# Altium project LimeSDR-PCIe_1v3.PrjPcb (part 7 of 7)
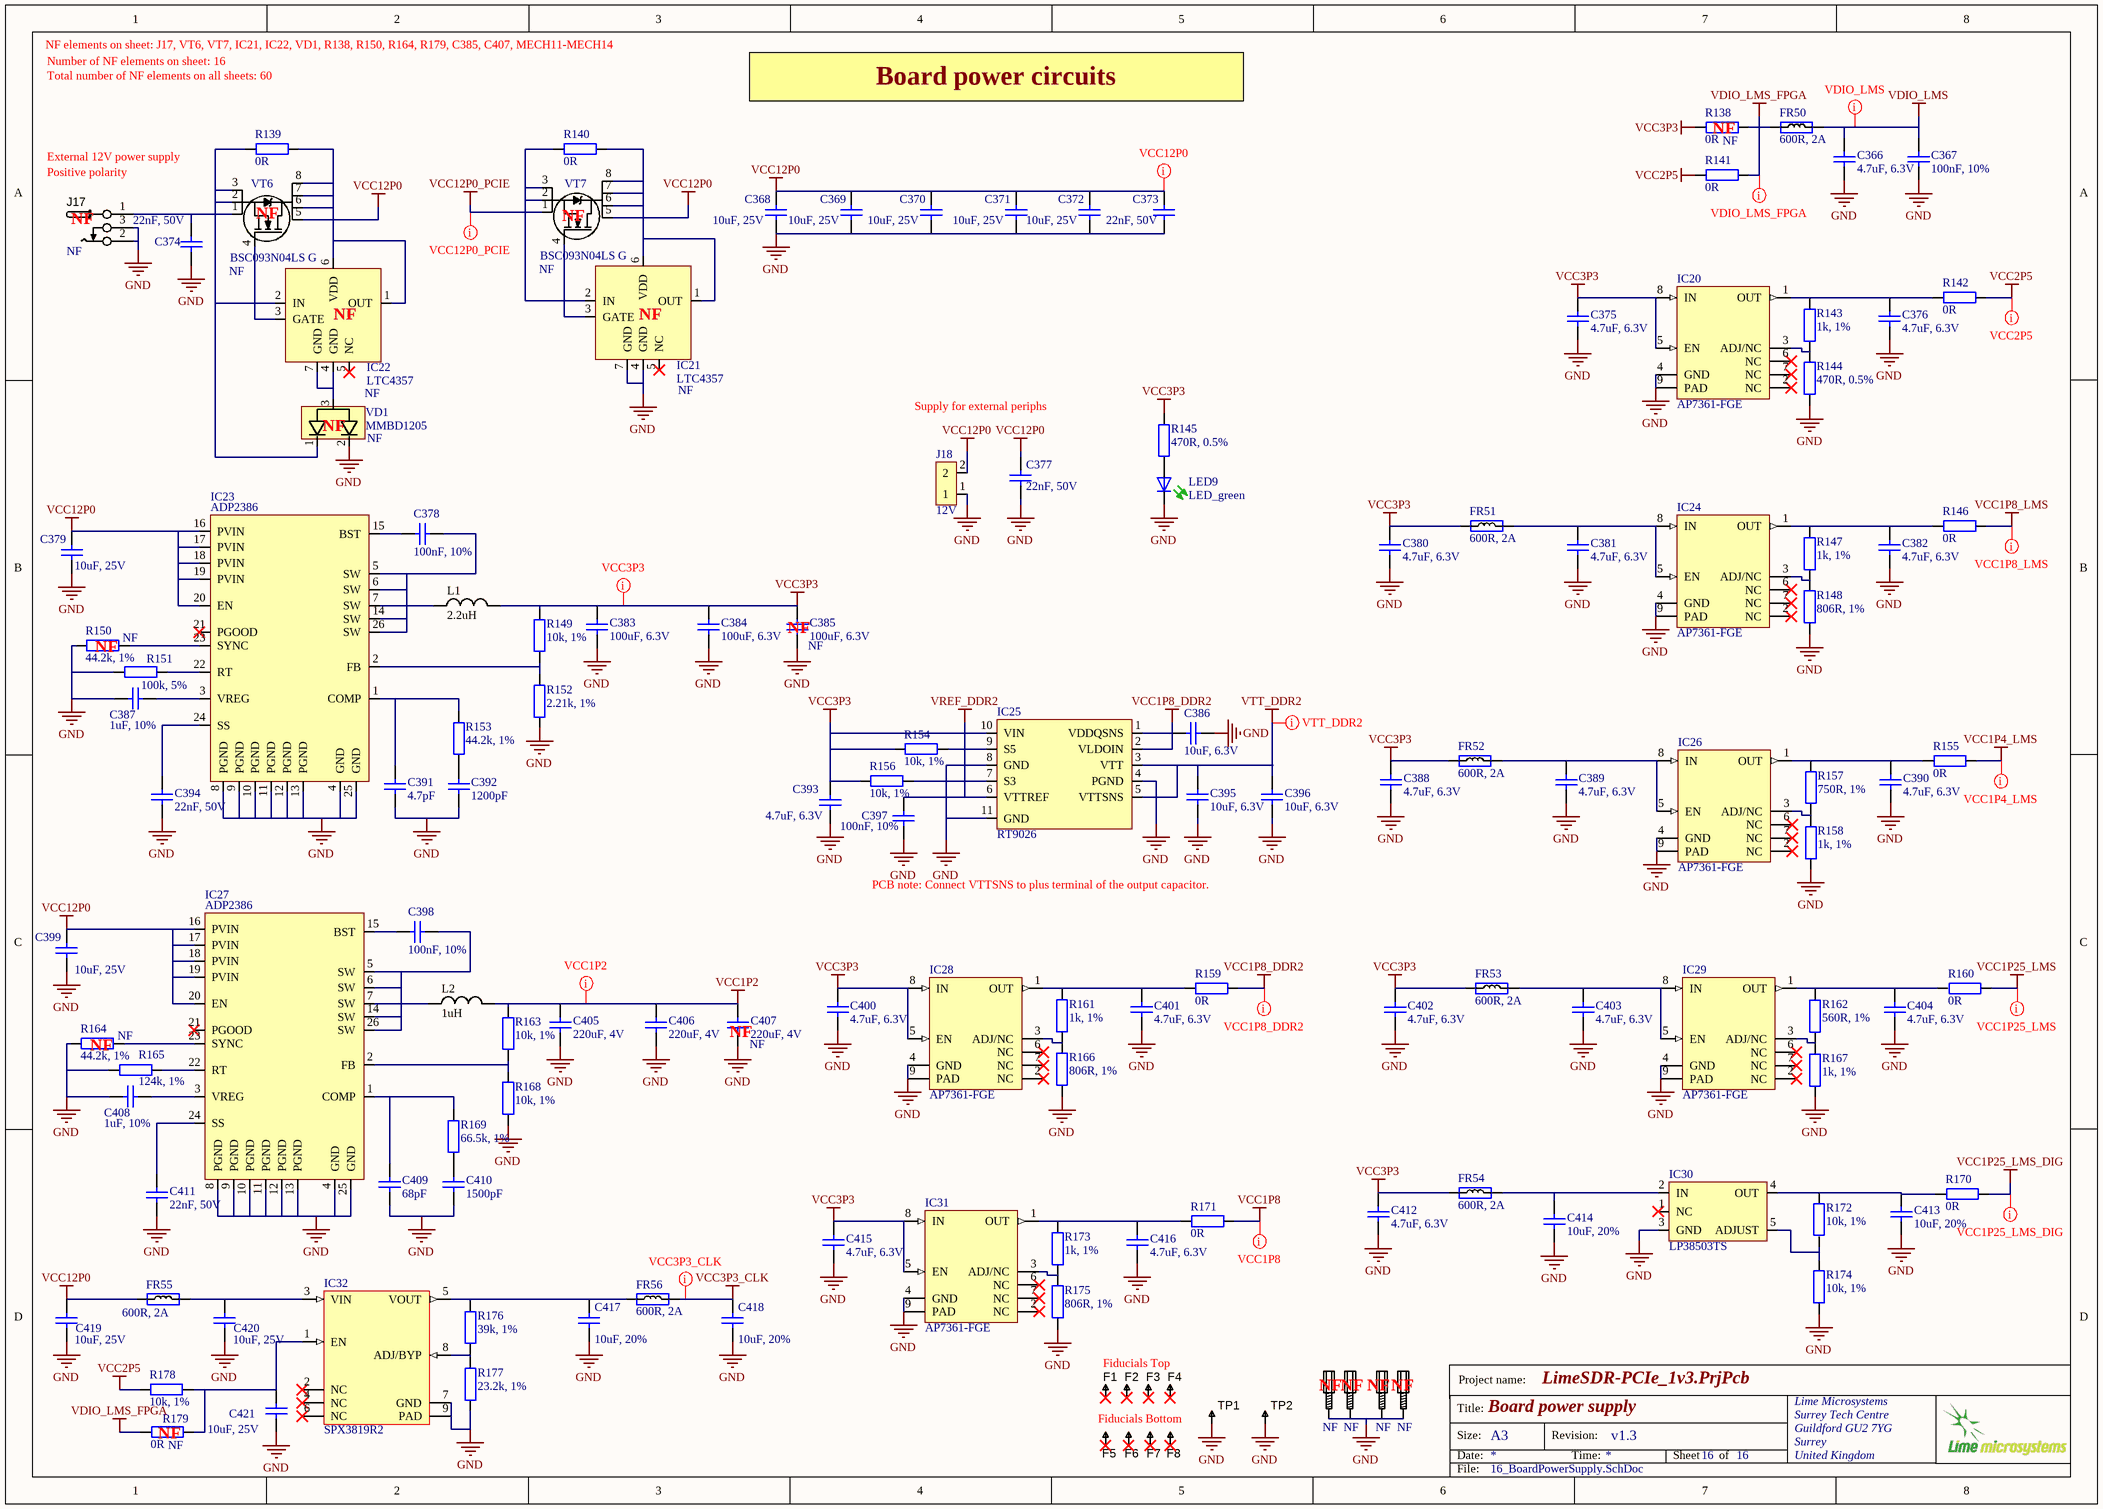
[diagram p17: 16_BoardPowerSupply.SchDoc]

## Nets that join several sheets
GND: 04_LMS7002M_Misc (13 pins), 05_LMS7002M_RF1 (41 pins), 06_LMS7002M_RF2 (31 pins), 07_LMS7002M_Power (84 pins), 08_FPGA_banks_3_4_5 (11 pins), 09_FPGA_banks_6_7_8 (17 pins), 10_FPGA_misc (13 pins), 11_FPGA_power (212 pins), 12_DDR2 (103 pins), 13_Periphs (55 pins), 14_Clocks_1 (74 pins), 15_Clocks_2 (9 pins), 16_BoardPowerSupply (115 pins)
VCC1P2: 11_FPGA_power (71 pins), 16_BoardPowerSupply (5 pins)
VCC1P4_LMS: 07_LMS7002M_Power (6 pins), 16_BoardPowerSupply (R155.1)
VCC1P8: 08_FPGA_banks_3_4_5 (R40.2 R42.2), 10_FPGA_misc (R63.1 R64.1), 11_FPGA_power (30 pins), 14_Clocks_1 (C354.1 FR42.1 IC19.14), 15_Clocks_2 (FR47.1 FR48.1), 16_BoardPowerSupply (R171.1)
VCC1P8_DDR2: 12_DDR2 (73 pins), 16_BoardPowerSupply (C386.2 IC25.1 IC25.2 R159.1)
VCC1P8_LMS: 05_LMS7002M_RF1 (9 pins), 06_LMS7002M_RF2 (9 pins), 07_LMS7002M_Power (11 pins), 16_BoardPowerSupply (R146.1)
VCC1P25_LMS: 07_LMS7002M_Power (22 pins), 16_BoardPowerSupply (R160.1)
VCC1P25_LMS_DIG: 07_LMS7002M_Power (R28.2 R29.2 R30.2 R31.2), 16_BoardPowerSupply (R170.1)
VCC2P5: 11_FPGA_power (FR38.1 FR39.1), 16_BoardPowerSupply (R141.2 R142.1 R178.1)
VCC2P5A_FPGA: 10_FPGA_misc (8 pins), 11_FPGA_power (21 pins)
VCC3P3: 09_FPGA_banks_6_7_8 (R44.2), 10_FPGA_misc (7 pins), 11_FPGA_power (24 pins), 13_Periphs (18 pins), 15_Clocks_2 (FR49.1), 16_BoardPowerSupply (28 pins)
VCC3P3_CLK: 14_Clocks_1 (18 pins), 16_BoardPowerSupply (C418.2 FR56.2)
VCC12P0: 13_Periphs (C301.1 J14.2), 16_BoardPowerSupply (36 pins)
VCC12P0_PCIE: 13_Periphs (10 pins), 16_BoardPowerSupply (5 pins)
VDIO_LMS: 04_LMS7002M_Misc (14 pins), 07_LMS7002M_Power (5 pins), 16_BoardPowerSupply (C366.2 C367.1 FR50.2)
VDIO_LMS_FPGA: 11_FPGA_power (20 pins), 14_Clocks_1 (C353.1 IC19.10 R120.2), 16_BoardPowerSupply (FR50.1 R138.1 R141.1 R179.2)
VREF_DDR2: 08_FPGA_banks_3_4_5 (18 pins), 12_DDR2 (C274.1 C299.1 IC11.J2 IC12.J2), 16_BoardPowerSupply (C397.1 IC25.6)
VTT_DDR2: 12_DDR2 (72 pins), 16_BoardPowerSupply (C395.2 C396.2 IC25.3 IC25.5)
ADF_MUXOUT: 09_FPGA_banks_6_7_8 (IC8.F18), 14_Clocks_1 (IC18.15 R131.1)
CLK50_FPGA: 08_FPGA_banks_3_4_5 (IC8.M21), 15_Clocks_2 (XO5.3)
CLK100_FPGA: 08_FPGA_banks_3_4_5 (IC8.AA12), 15_Clocks_2 (XO4.3)
CLK125_FPGA_N: 08_FPGA_banks_3_4_5 (IC8.N8), 15_Clocks_2 (XO6.5)
CLK125_FPGA_P: 08_FPGA_banks_3_4_5 (IC8.M8), 15_Clocks_2 (XO6.4)
DDR2_1_A0: 08_FPGA_banks_3_4_5 (IC8.W20), 12_DDR2 (IC11.M8 R74.5)
DDR2_1_A1: 08_FPGA_banks_3_4_5 (IC8.AA19), 12_DDR2 (IC11.M3 R72.5)
DDR2_1_A2: 08_FPGA_banks_3_4_5 (IC8.AA21), 12_DDR2 (IC11.M7 R72.2)
DDR2_1_A3: 08_FPGA_banks_3_4_5 (IC8.AB19), 12_DDR2 (IC11.N2 R75.3)
DDR2_1_A4: 08_FPGA_banks_3_4_5 (IC8.V21), 12_DDR2 (IC11.N8 R74.6)
DDR2_1_A5: 08_FPGA_banks_3_4_5 (IC8.AB20), 12_DDR2 (IC11.N3 R72.6)
DDR2_1_A6: 08_FPGA_banks_3_4_5 (IC8.W22), 12_DDR2 (IC11.N7 R72.1)
DDR2_1_A7: 08_FPGA_banks_3_4_5 (IC8.AA20), 12_DDR2 (IC11.P2 R75.2)
DDR2_1_A8: 08_FPGA_banks_3_4_5 (IC8.V22), 12_DDR2 (IC11.P8 R74.7)
DDR2_1_A9: 08_FPGA_banks_3_4_5 (IC8.AB21), 12_DDR2 (IC11.P3 R72.7)
DDR2_1_A10: 08_FPGA_banks_3_4_5 (IC8.AB17), 12_DDR2 (IC11.M2 R75.4)
DDR2_1_A11: 08_FPGA_banks_3_4_5 (IC8.U22), 12_DDR2 (IC11.P7 R74.8)
DDR2_1_A12: 08_FPGA_banks_3_4_5 (IC8.Y22), 12_DDR2 (IC11.R2 R72.8)
DDR2_1_BA0: 08_FPGA_banks_3_4_5 (IC8.T20), 12_DDR2 (IC11.L2 R75.5)
DDR2_1_BA1: 08_FPGA_banks_3_4_5 (IC8.R20), 12_DDR2 (IC11.L3 R75.7)
DDR2_1_BA2: 08_FPGA_banks_3_4_5 (IC8.U20), 12_DDR2 (IC11.L1 R75.6)
DDR2_1_CASn: 08_FPGA_banks_3_4_5 (IC8.P22), 12_DDR2 (IC11.L7 R72.3)
DDR2_1_CK_N: 08_FPGA_banks_3_4_5 (IC8.T9), 12_DDR2 (IC11.K8 R73.2)
DDR2_1_CK_P: 08_FPGA_banks_3_4_5 (IC8.R9), 12_DDR2 (IC11.J8 R73.1)
DDR2_1_CKE: 08_FPGA_banks_3_4_5 (IC8.T19), 12_DDR2 (IC11.K2 R75.8)
DDR2_1_CSn: 08_FPGA_banks_3_4_5 (IC8.T22), 12_DDR2 (IC11.L8 R74.4)
DDR2_1_DM0: 08_FPGA_banks_3_4_5 (IC8.R13), 12_DDR2 (IC11.F3)
DDR2_1_DM1: 08_FPGA_banks_3_4_5 (IC8.U15), 12_DDR2 (IC11.B3)
DDR2_1_DQ0: 08_FPGA_banks_3_4_5 (IC8.AB10), 12_DDR2 (IC11.G8)
DDR2_1_DQ1: 08_FPGA_banks_3_4_5 (IC8.AB14), 12_DDR2 (IC11.G2)
DDR2_1_DQ2: 08_FPGA_banks_3_4_5 (IC8.AB15), 12_DDR2 (IC11.H7)
DDR2_1_DQ3: 08_FPGA_banks_3_4_5 (IC8.Y13), 12_DDR2 (IC11.H3)
DDR2_1_DQ4: 08_FPGA_banks_3_4_5 (IC8.Y14), 12_DDR2 (IC11.H1)
DDR2_1_DQ5: 08_FPGA_banks_3_4_5 (IC8.W13), 12_DDR2 (IC11.H9)
DDR2_1_DQ6: 08_FPGA_banks_3_4_5 (IC8.W14), 12_DDR2 (IC11.F1)
DDR2_1_DQ7: 08_FPGA_banks_3_4_5 (IC8.W15), 12_DDR2 (IC11.F9)
DDR2_1_DQ8: 08_FPGA_banks_3_4_5 (IC8.AB18), 12_DDR2 (IC11.C8)
DDR2_1_DQ9: 08_FPGA_banks_3_4_5 (IC8.AA16), 12_DDR2 (IC11.C2)
DDR2_1_DQ10: 08_FPGA_banks_3_4_5 (IC8.AA18), 12_DDR2 (IC11.D7)
DDR2_1_DQ11: 08_FPGA_banks_3_4_5 (IC8.Y15), 12_DDR2 (IC11.D3)
DDR2_1_DQ12: 08_FPGA_banks_3_4_5 (IC8.Y16), 12_DDR2 (IC11.D1)
DDR2_1_DQ13: 08_FPGA_banks_3_4_5 (IC8.Y18), 12_DDR2 (IC11.D9)
DDR2_1_DQ14: 08_FPGA_banks_3_4_5 (IC8.Y19), 12_DDR2 (IC11.B1)
DDR2_1_DQ15: 08_FPGA_banks_3_4_5 (IC8.W17), 12_DDR2 (IC11.B9)
DDR2_1_DQS0: 08_FPGA_banks_3_4_5 (IC8.T13), 12_DDR2 (IC11.F7)
DDR2_1_DQS1: 08_FPGA_banks_3_4_5 (IC8.AA15), 12_DDR2 (IC11.B7)
DDR2_1_ODT: 08_FPGA_banks_3_4_5 (IC8.R21), 12_DDR2 (IC11.K9 R74.3)
DDR2_1_RASn: 08_FPGA_banks_3_4_5 (IC8.T21), 12_DDR2 (IC11.K7 R72.4)
DDR2_1_WEn: 08_FPGA_banks_3_4_5 (IC8.V20), 12_DDR2 (IC11.K3 R74.2)
DDR2_2_A0: 08_FPGA_banks_3_4_5 (IC8.M13), 12_DDR2 (IC12.M8 R80.5)
DDR2_2_A1: 08_FPGA_banks_3_4_5 (IC8.P14), 12_DDR2 (IC12.M3 R78.5)
DDR2_2_A2: 08_FPGA_banks_3_4_5 (IC8.M14), 12_DDR2 (IC12.M7 R78.2)
DDR2_2_A3: 08_FPGA_banks_3_4_5 (IC8.T11), 12_DDR2 (IC12.N2 R81.2)
DDR2_2_A4: 08_FPGA_banks_3_4_5 (IC8.N13), 12_DDR2 (IC12.N8 R80.6)
DDR2_2_A5: 08_FPGA_banks_3_4_5 (IC8.N15), 12_DDR2 (IC12.N3 R78.6)
DDR2_2_A6: 08_FPGA_banks_3_4_5 (IC8.M15), 12_DDR2 (IC12.N7 R78.1)
DDR2_2_A7: 08_FPGA_banks_3_4_5 (IC8.M16), 12_DDR2 (IC12.P2 R81.1)
DDR2_2_A8: 08_FPGA_banks_3_4_5 (IC8.P13), 12_DDR2 (IC12.P8 R80.7)
DDR2_2_A9: 08_FPGA_banks_3_4_5 (IC8.P15), 12_DDR2 (IC12.P3 R78.7)
DDR2_2_A10: 08_FPGA_banks_3_4_5 (IC8.R15), 12_DDR2 (IC12.M2 R81.3)
DDR2_2_A11: 08_FPGA_banks_3_4_5 (IC8.N14), 12_DDR2 (IC12.P7 R80.8)
DDR2_2_A12: 08_FPGA_banks_3_4_5 (IC8.N17), 12_DDR2 (IC12.R2 R78.8)
DDR2_2_BA0: 08_FPGA_banks_3_4_5 (IC8.AB13), 12_DDR2 (IC12.L2 R81.4)
DDR2_2_BA1: 08_FPGA_banks_3_4_5 (IC8.AA13), 12_DDR2 (IC12.L3 R81.6)
DDR2_2_BA2: 08_FPGA_banks_3_4_5 (IC8.AA4), 12_DDR2 (IC12.L1 R81.5)
DDR2_2_CASn: 08_FPGA_banks_3_4_5 (IC8.R19), 12_DDR2 (IC12.L7 R78.3)
DDR2_2_CK_N: 08_FPGA_banks_3_4_5 (IC8.Y4), 12_DDR2 (IC12.K8 R79.2)
DDR2_2_CK_P: 08_FPGA_banks_3_4_5 (IC8.W4), 12_DDR2 (IC12.J8 R79.1)
DDR2_2_CKE: 08_FPGA_banks_3_4_5 (IC8.T14), 12_DDR2 (IC12.K2 R81.7)
DDR2_2_CSn: 08_FPGA_banks_3_4_5 (IC8.AB11), 12_DDR2 (IC12.L8 R80.4)
DDR2_2_DM0: 08_FPGA_banks_3_4_5 (IC8.W7), 12_DDR2 (IC12.F3)
DDR2_2_DM1: 08_FPGA_banks_3_4_5 (IC8.W12), 12_DDR2 (IC12.B3)
DDR2_2_DQ0: 08_FPGA_banks_3_4_5 (IC8.AB4), 12_DDR2 (IC12.G8)
DDR2_2_DQ1: 08_FPGA_banks_3_4_5 (IC8.AB5), 12_DDR2 (IC12.G2)
DDR2_2_DQ2: 08_FPGA_banks_3_4_5 (IC8.AA6), 12_DDR2 (IC12.H7)
DDR2_2_DQ3: 08_FPGA_banks_3_4_5 (IC8.Y5), 12_DDR2 (IC12.H3)
DDR2_2_DQ4: 08_FPGA_banks_3_4_5 (IC8.Y6), 12_DDR2 (IC12.H1)
DDR2_2_DQ5: 08_FPGA_banks_3_4_5 (IC8.Y7), 12_DDR2 (IC12.H9)
DDR2_2_DQ6: 08_FPGA_banks_3_4_5 (IC8.W5), 12_DDR2 (IC12.F1)
DDR2_2_DQ7: 08_FPGA_banks_3_4_5 (IC8.W6), 12_DDR2 (IC12.F9)
DDR2_2_DQ8: 08_FPGA_banks_3_4_5 (IC8.AB6), 12_DDR2 (IC12.C8)
DDR2_2_DQ9: 08_FPGA_banks_3_4_5 (IC8.W9), 12_DDR2 (IC12.C2)
DDR2_2_DQ10: 08_FPGA_banks_3_4_5 (IC8.Y9), 12_DDR2 (IC12.D7)
DDR2_2_DQ11: 08_FPGA_banks_3_4_5 (IC8.AA9), 12_DDR2 (IC12.D3)
DDR2_2_DQ12: 08_FPGA_banks_3_4_5 (IC8.AB8), 12_DDR2 (IC12.D1)
DDR2_2_DQ13: 08_FPGA_banks_3_4_5 (IC8.W11), 12_DDR2 (IC12.D9)
DDR2_2_DQ14: 08_FPGA_banks_3_4_5 (IC8.Y11), 12_DDR2 (IC12.B1)
DDR2_2_DQ15: 08_FPGA_banks_3_4_5 (IC8.AA10), 12_DDR2 (IC12.B9)
DDR2_2_DQS0: 08_FPGA_banks_3_4_5 (IC8.Y8), 12_DDR2 (IC12.F7)
DDR2_2_DQS1: 08_FPGA_banks_3_4_5 (IC8.Y10), 12_DDR2 (IC12.B7)
DDR2_2_ODT: 08_FPGA_banks_3_4_5 (IC8.W18), 12_DDR2 (IC12.K9 R80.3)
DDR2_2_RASn: 08_FPGA_banks_3_4_5 (IC8.U14), 12_DDR2 (IC12.K7 R78.4)
DDR2_2_WEn: 08_FPGA_banks_3_4_5 (IC8.T15), 12_DDR2 (IC12.K3 R80.2)
FAN_CTRL: 09_FPGA_banks_6_7_8 (IC8.K13), 13_Periphs (VT5.G)
FPGA_CLK_OUT: 09_FPGA_banks_6_7_8 (IC8.C18), 14_Clocks_1 (R112.2)
FPGA_GPIO0: 09_FPGA_banks_6_7_8 (IC8.B12), 13_Periphs (J12.1)
FPGA_GPIO1: 09_FPGA_banks_6_7_8 (IC8.C16), 13_Periphs (J12.2)
FPGA_GPIO2: 09_FPGA_banks_6_7_8 (IC8.B15), 13_Periphs (J12.3)
FPGA_GPIO3: 09_FPGA_banks_6_7_8 (IC8.B13), 13_Periphs (J12.4)
FPGA_GPIO4: 09_FPGA_banks_6_7_8 (IC8.A15), 13_Periphs (J12.5)
FPGA_GPIO5: 09_FPGA_banks_6_7_8 (IC8.B16), 13_Periphs (J12.6)
FPGA_GPIO6: 09_FPGA_banks_6_7_8 (IC8.A17), 13_Periphs (J12.7)
FPGA_GPIO7: 09_FPGA_banks_6_7_8 (IC8.A16), 13_Periphs (J12.8)
FPGA_GPIO8: 09_FPGA_banks_6_7_8 (IC8.G15), 13_Periphs (J13.1)
FPGA_GPIO9: 09_FPGA_banks_6_7_8 (IC8.G14), 13_Periphs (J13.2)
FPGA_GPIO10: 09_FPGA_banks_6_7_8 (IC8.D14), 13_Periphs (J13.3)
FPGA_GPIO11: 09_FPGA_banks_6_7_8 (IC8.D15), 13_Periphs (J13.4)
FPGA_GPIO12: 09_FPGA_banks_6_7_8 (IC8.C14), 13_Periphs (J13.5)
FPGA_GPIO13: 09_FPGA_banks_6_7_8 (IC8.C15), 13_Periphs (J13.6)
FPGA_GPIO14: 09_FPGA_banks_6_7_8 (IC8.C12), 13_Periphs (J13.7)
FPGA_GPIO15: 09_FPGA_banks_6_7_8 (IC8.C13), 13_Periphs (J13.8)
FPGA_I2C_SCL: 09_FPGA_banks_6_7_8 (IC8.G17), 13_Periphs (IC14.2 IC15.6 R104.2), 14_Clocks_1 (IC19.4)
FPGA_I2C_SDA: 09_FPGA_banks_6_7_8 (IC8.G16), 13_Periphs (IC14.1 IC15.5 R103.2), 14_Clocks_1 (IC19.5)
FPGA_LED1_G: 09_FPGA_banks_6_7_8 (IC8.H21), 13_Periphs (R89.1)
FPGA_LED1_R: 09_FPGA_banks_6_7_8 (IC8.E20), 13_Periphs (LED1.2 LED1.3 LEDS1.K1)
FPGA_LED2_G: 09_FPGA_banks_6_7_8 (IC8.G20), 13_Periphs (R90.1)
FPGA_LED2_R: 09_FPGA_banks_6_7_8 (IC8.G21), 13_Periphs (LED4.2 LED4.3 LEDS1.K2)
FPGA_LED3: 09_FPGA_banks_6_7_8 (IC8.K20), 13_Periphs (R94.1)
FPGA_LED4: 09_FPGA_banks_6_7_8 (IC8.K19), 13_Periphs (R95.1)
FPGA_LED5: 09_FPGA_banks_6_7_8 (IC8.K22), 13_Periphs (R96.1)
FPGA_LED6: 09_FPGA_banks_6_7_8 (IC8.H20), 13_Periphs (R97.1)
FPGA_SPI0_LMS_SS: 04_LMS7002M_Misc (R9.2), 09_FPGA_banks_6_7_8 (IC8.B1)
FPGA_SPI0_MISO: 04_LMS7002M_Misc (R8.2), 09_FPGA_banks_6_7_8 (IC8.A3)
FPGA_SPI0_MOSI: 04_LMS7002M_Misc (R7.2), 09_FPGA_banks_6_7_8 (IC8.C1)
FPGA_SPI0_SCLK: 04_LMS7002M_Misc (R6.2), 09_FPGA_banks_6_7_8 (IC8.B3)
FPGA_SPI1_ADF_SS: 09_FPGA_banks_6_7_8 (IC8.B19), 14_Clocks_1 (R137.1)
FPGA_SPI1_DAC_SS: 09_FPGA_banks_6_7_8 (IC8.A20), 14_Clocks_1 (IC17.1)
FPGA_SPI1_MOSI: 09_FPGA_banks_6_7_8 (IC8.C19), 14_Clocks_1 (IC17.3 R136.1)
FPGA_SPI1_SCLK: 09_FPGA_banks_6_7_8 (IC8.C20), 14_Clocks_1 (IC17.2 R135.1)
FPGA_SPI2_FLASH_SS: 09_FPGA_banks_6_7_8 (IC8.J22), 13_Periphs (IC13.1 R91.2)
FPGA_SPI2_MISO: 09_FPGA_banks_6_7_8 (IC8.J21), 13_Periphs (IC13.2)
FPGA_SPI2_MOSI: 09_FPGA_banks_6_7_8 (IC8.H22), 13_Periphs (IC13.5)
FPGA_SPI2_SCLK: 09_FPGA_banks_6_7_8 (IC8.J19), 13_Periphs (IC13.6 R84.2)
FPGA_SW0: 09_FPGA_banks_6_7_8 (IC8.D22), 13_Periphs (R88.2 SW1.8)
FPGA_SW1: 09_FPGA_banks_6_7_8 (IC8.E21), 13_Periphs (R87.2 SW1.7)
FPGA_SW2: 09_FPGA_banks_6_7_8 (IC8.E22), 13_Periphs (R86.2 SW1.6)
FPGA_SW3: 09_FPGA_banks_6_7_8 (IC8.G22), 13_Periphs (R85.2 SW1.5)
LM75_OS: 09_FPGA_banks_6_7_8 (IC8.K14), 13_Periphs (IC14.3 R105.2)
LMK_CLK: 09_FPGA_banks_6_7_8 (IC8.B9), 14_Clocks_1 (IC16.15)
LMS_CORE_LDO_EN: 04_LMS7002M_Misc (IC1.U33 R5.1), 09_FPGA_banks_6_7_8 (IC8.C4)
LMS_DIQ1_D0: 04_LMS7002M_Misc (IC1.AG31), 09_FPGA_banks_6_7_8 (IC8.D9)
LMS_DIQ1_D1: 04_LMS7002M_Misc (IC1.AF30), 09_FPGA_banks_6_7_8 (IC8.B7)
LMS_DIQ1_D2: 04_LMS7002M_Misc (IC1.AF34), 09_FPGA_banks_6_7_8 (IC8.H8)
LMS_DIQ1_D3: 04_LMS7002M_Misc (IC1.AE31), 09_FPGA_banks_6_7_8 (IC8.C8)
LMS_DIQ1_D4: 04_LMS7002M_Misc (IC1.AD30), 09_FPGA_banks_6_7_8 (IC8.C7)
LMS_DIQ1_D5: 04_LMS7002M_Misc (IC1.AC29), 09_FPGA_banks_6_7_8 (IC8.C9)
LMS_DIQ1_D6: 04_LMS7002M_Misc (IC1.AE33), 09_FPGA_banks_6_7_8 (IC8.H7)
LMS_DIQ1_D7: 04_LMS7002M_Misc (IC1.AD32), 09_FPGA_banks_6_7_8 (IC8.G8)
LMS_DIQ1_D8: 04_LMS7002M_Misc (IC1.AC31), 09_FPGA_banks_6_7_8 (IC8.E8)
LMS_DIQ1_D9: 04_LMS7002M_Misc (IC1.AC33), 09_FPGA_banks_6_7_8 (IC8.G7)
LMS_DIQ1_D10: 04_LMS7002M_Misc (IC1.AB30), 09_FPGA_banks_6_7_8 (IC8.F8)
LMS_DIQ1_D11: 04_LMS7002M_Misc (IC1.AB32), 09_FPGA_banks_6_7_8 (IC8.E6)
LMS_DIQ2_D0: 04_LMS7002M_Misc (IC1.H30), 09_FPGA_banks_6_7_8 (IC8.G6)
LMS_DIQ2_D1: 04_LMS7002M_Misc (IC1.J31), 09_FPGA_banks_6_7_8 (IC8.E5)
LMS_DIQ2_D2: 04_LMS7002M_Misc (IC1.K30), 09_FPGA_banks_6_7_8 (IC8.A8)
LMS_DIQ2_D3: 04_LMS7002M_Misc (IC1.K32), 09_FPGA_banks_6_7_8 (IC8.D7)
LMS_DIQ2_D4: 04_LMS7002M_Misc (IC1.L31), 09_FPGA_banks_6_7_8 (IC8.D8)
LMS_DIQ2_D5: 04_LMS7002M_Misc (IC1.K34), 09_FPGA_banks_6_7_8 (IC8.F6)
LMS_DIQ2_D6: 04_LMS7002M_Misc (IC1.M30), 09_FPGA_banks_6_7_8 (IC8.C6)
LMS_DIQ2_D7: 04_LMS7002M_Misc (IC1.M32), 09_FPGA_banks_6_7_8 (IC8.D4)
LMS_DIQ2_D8: 04_LMS7002M_Misc (IC1.N31), 09_FPGA_banks_6_7_8 (IC8.A5)
LMS_DIQ2_D9: 04_LMS7002M_Misc (IC1.N33), 09_FPGA_banks_6_7_8 (IC8.D5)
LMS_DIQ2_D10: 04_LMS7002M_Misc (IC1.P30), 09_FPGA_banks_6_7_8 (IC8.B4)
LMS_DIQ2_D11: 04_LMS7002M_Misc (IC1.P32), 09_FPGA_banks_6_7_8 (IC8.A6)
LMS_ENABLE_IQSEL1: 04_LMS7002M_Misc (IC1.Y32), 09_FPGA_banks_6_7_8 (IC8.D6)
LMS_ENABLE_IQSEL2: 04_LMS7002M_Misc (IC1.R33), 09_FPGA_banks_6_7_8 (IC8.B6)
LMS_FCLK1: 04_LMS7002M_Misc (IC1.AA33), 09_FPGA_banks_6_7_8 (IC8.H9)
LMS_FCLK2: 04_LMS7002M_Misc (IC1.R29), 09_FPGA_banks_6_7_8 (IC8.C5)
LMS_I2C_SCL: 04_LMS7002M_Misc (IC1.C27 IC2.6 IC3.6 R12.2), 09_FPGA_banks_6_7_8 (R51.1)
LMS_I2C_SDA: 04_LMS7002M_Misc (IC1.D26 IC2.5 IC3.5 R13.2), 09_FPGA_banks_6_7_8 (R46.1)
LMS_MCLK1: 04_LMS7002M_Misc (IC1.AB34), 09_FPGA_banks_6_7_8 (IC8.K10)
LMS_MCLK2: 04_LMS7002M_Misc (IC1.P34), 08_FPGA_banks_3_4_5 (IC8.M11)
LMS_RESET: 04_LMS7002M_Misc (IC1.E27 R2.1), 09_FPGA_banks_6_7_8 (IC8.A1)
LMS_RXEN: 04_LMS7002M_Misc (IC1.V34 R4.2), 09_FPGA_banks_6_7_8 (IC8.C2)
LMS_TXEN: 04_LMS7002M_Misc (IC1.U29 R3.2), 09_FPGA_banks_6_7_8 (IC8.A7)
LMS_TXNRX1: 04_LMS7002M_Misc (IC1.V32 R1.1), 09_FPGA_banks_6_7_8 (IC8.C3)
LMS_TXNRX2: 04_LMS7002M_Misc (IC1.U31 R10.2), 09_FPGA_banks_6_7_8 (IC8.A4)
PCIE_HSI0_N: 10_FPGA_misc (C118.2), 13_Periphs (P1.A17)
PCIE_HSI0_P: 10_FPGA_misc (C117.2), 13_Periphs (P1.A16)
PCIE_HSI1_N: 10_FPGA_misc (C116.2), 13_Periphs (P1.A22)
PCIE_HSI1_P: 10_FPGA_misc (C115.2), 13_Periphs (P1.A21)
PCIE_HSI2_N: 10_FPGA_misc (C114.2), 13_Periphs (P1.A26)
PCIE_HSI2_P: 10_FPGA_misc (C112.2), 13_Periphs (P1.A25)
PCIE_HSI3_N: 10_FPGA_misc (C111.2), 13_Periphs (P1.A30)
PCIE_HSI3_P: 10_FPGA_misc (C110.2), 13_Periphs (P1.A29)
PCIE_HSO0_N: 10_FPGA_misc (IC8.Y1), 13_Periphs (P1.B15)
PCIE_HSO0_P: 10_FPGA_misc (IC8.Y2), 13_Periphs (P1.B14)
PCIE_HSO1_N: 10_FPGA_misc (IC8.T1), 13_Periphs (P1.B20)
PCIE_HSO1_P: 10_FPGA_misc (IC8.T2), 13_Periphs (P1.B19)
PCIE_HSO2_N: 10_FPGA_misc (IC8.M1), 13_Periphs (P1.B24)
PCIE_HSO2_P: 10_FPGA_misc (IC8.M2), 13_Periphs (P1.B23)
PCIE_HSO3_N: 10_FPGA_misc (IC8.H1), 13_Periphs (P1.B28)
PCIE_HSO3_P: 10_FPGA_misc (IC8.H2), 13_Periphs (P1.B27)
PCIE_PERSTn: 09_FPGA_banks_6_7_8 (IC8.H12), 13_Periphs (P1.A11)
PCIE_REFCLK_N: 08_FPGA_banks_3_4_5 (IC8.N7), 13_Periphs (P1.A14)
PCIE_REFCLK_P: 08_FPGA_banks_3_4_5 (IC8.M7), 13_Periphs (P1.A13)
PCIE_SMCLK: 09_FPGA_banks_6_7_8 (IC8.A10), 13_Periphs (P1.B5)
PCIE_SMDAT: 09_FPGA_banks_6_7_8 (IC8.B10), 13_Periphs (P1.B6)
PCIE_WAKEn: 09_FPGA_banks_6_7_8 (IC8.G12), 13_Periphs (R100.1)
RxPLL_CLK: 04_LMS7002M_Misc (IC1.AM24), 14_Clocks_1 (C316.2 R113.1)
SI_CLK0: 09_FPGA_banks_6_7_8 (IC8.L21), 14_Clocks_1 (IC19.13)
SI_CLK1: 09_FPGA_banks_6_7_8 (IC8.L22), 14_Clocks_1 (IC19.12)
SI_CLK2: 09_FPGA_banks_6_7_8 (IC8.J10), 14_Clocks_1 (IC19.9)
SI_CLK3: 08_FPGA_banks_3_4_5 (IC8.N11), 14_Clocks_1 (IC19.8)
SI_CLK5: 09_FPGA_banks_6_7_8 (IC8.A9), 14_Clocks_1 (IC19.17)
SI_CLK6: 08_FPGA_banks_3_4_5 (IC8.M22), 14_Clocks_1 (IC19.16)
SI_CLK7: 08_FPGA_banks_3_4_5 (IC8.AB12), 14_Clocks_1 (IC19.15)
TX1_2_LB_H: 05_LMS7002M_RF1 (C11.2 C21.2 IC4.4 IC5.6), 09_FPGA_banks_6_7_8 (IC8.A21)
TX1_2_LB_L: 05_LMS7002M_RF1 (C12.2 C20.2 IC4.6 IC5.4), 09_FPGA_banks_6_7_8 (IC8.A22)
TX1_2_LB_SH: 05_LMS7002M_RF1 (C16.1 C17.1 R15.2 R16.1), 09_FPGA_banks_6_7_8 (IC8.B20)
TX2_2_LB_H: 06_LMS7002M_RF2 (C30.2 C40.2 IC6.4 IC7.6), 09_FPGA_banks_6_7_8 (IC8.B21)
TX2_2_LB_L: 06_LMS7002M_RF2 (C31.2 C39.2 IC6.6 IC7.4), 09_FPGA_banks_6_7_8 (IC8.B22)
TX2_2_LB_SH: 06_LMS7002M_RF2 (C35.1 C36.1 R18.1 R19.2), 09_FPGA_banks_6_7_8 (IC8.C22)
TxPLL_CLK: 04_LMS7002M_Misc (IC1.E5), 14_Clocks_1 (C315.2 R110.1)